# Altium schematic sheet 02_CPU_SYSTEM.SchDoc
size A3; SheetNumber: 2
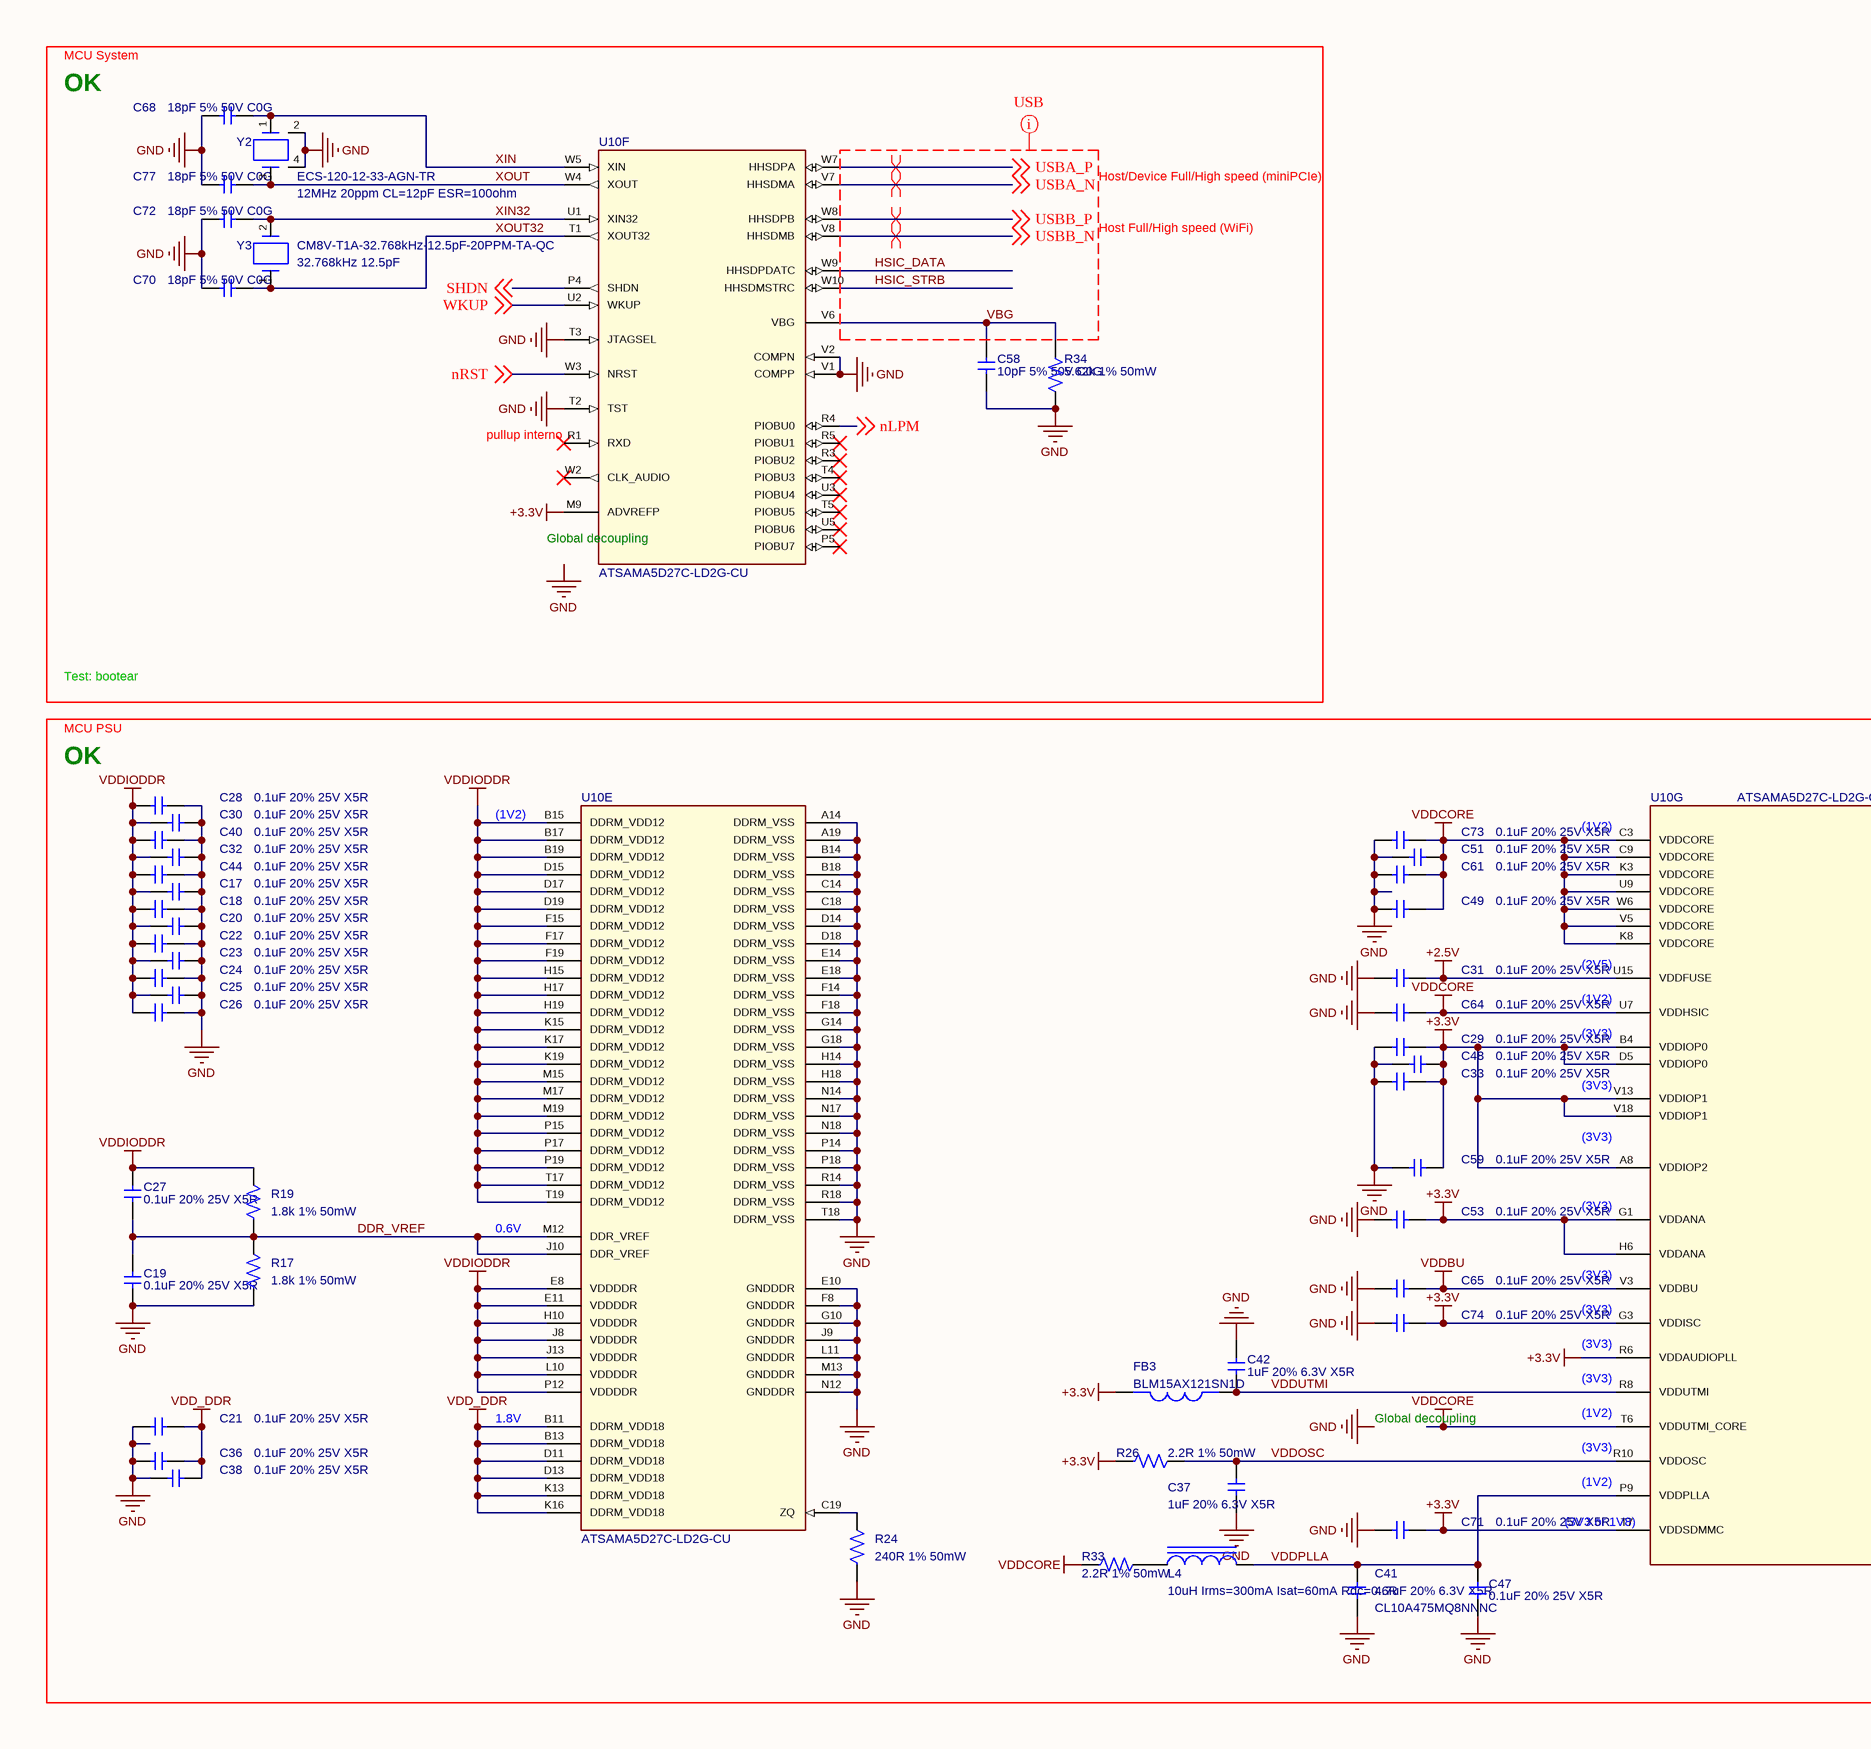
[diagram p0: 02_CPU_SYSTEM.SchDoc, left]
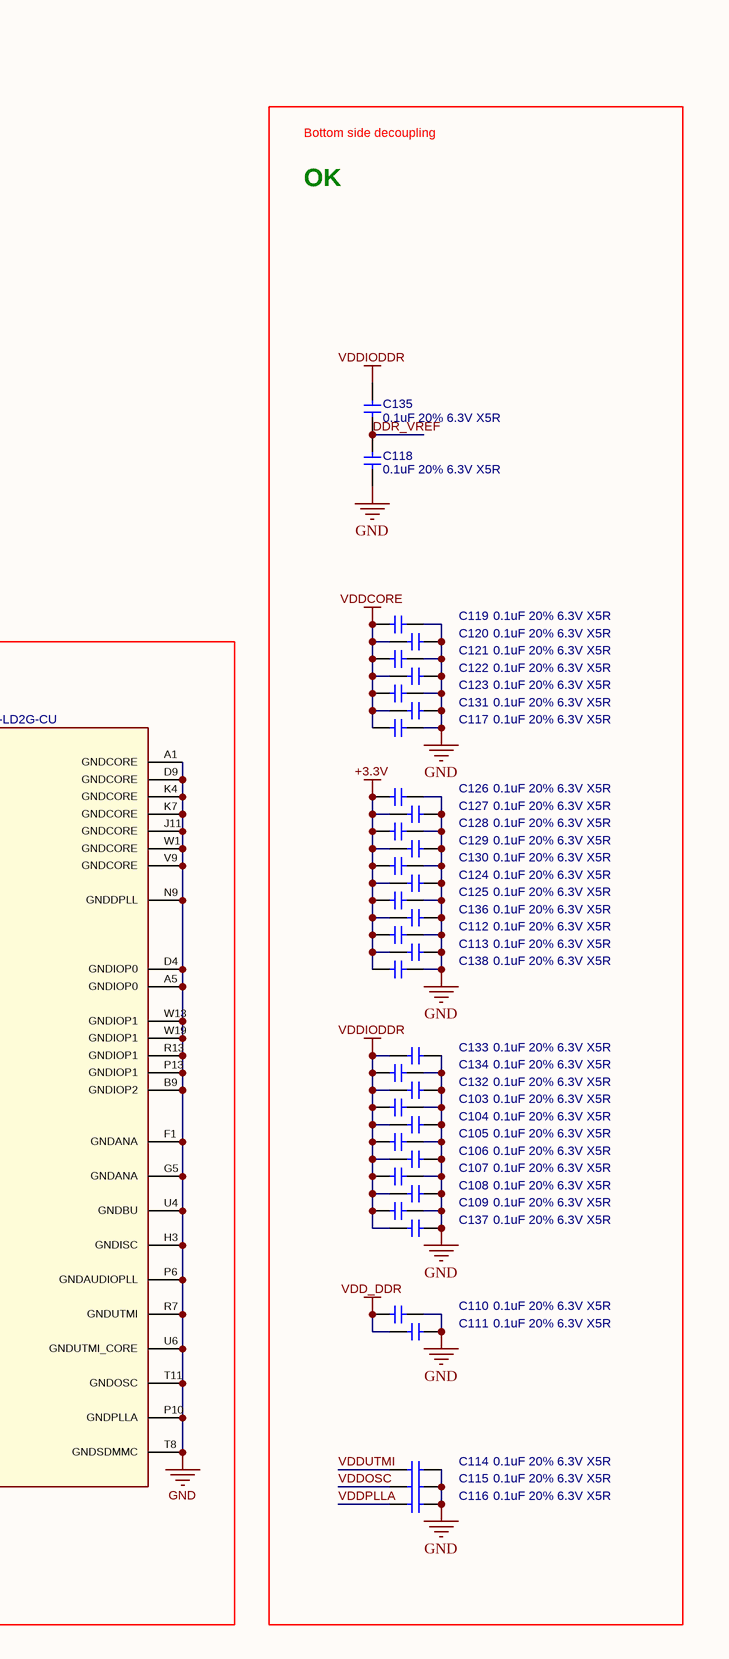
[diagram p1: 02_CPU_SYSTEM.SchDoc, right]

## Parts
C17  0.1uF 20% 25V X5R  [CAPC1005N]
C18  0.1uF 20% 25V X5R  [CAPC1005N]
C19  0.1uF 20% 25V X5R  [CAPC1005N]
C20  0.1uF 20% 25V X5R  [CAPC1005N]
C21  0.1uF 20% 25V X5R  [CAPC1005N]
C22  0.1uF 20% 25V X5R  [CAPC1005N]
C23  0.1uF 20% 25V X5R  [CAPC1005N]
C24  0.1uF 20% 25V X5R  [CAPC1005N]
C25  0.1uF 20% 25V X5R  [CAPC1005N]
C26  0.1uF 20% 25V X5R  [CAPC1005N]
C27  0.1uF 20% 25V X5R  [CAPC1005N]
C28  0.1uF 20% 25V X5R  [CAPC1005N]
C29  0.1uF 20% 25V X5R  [CAPC1005N]
C30  0.1uF 20% 25V X5R  [CAPC1005N]
C31  0.1uF 20% 25V X5R  [CAPC1005N]
C32  0.1uF 20% 25V X5R  [CAPC1005N]
C33  0.1uF 20% 25V X5R  [CAPC1005N]
C36  0.1uF 20% 25V X5R  [CAPC1005N]
C37  1uF 20% 6.3V X5R  [CAPC1005N]
C38  0.1uF 20% 25V X5R  [CAPC1005N]
C40  0.1uF 20% 25V X5R  [CAPC1005N]
C41  4.7uF 20% 6.3V X5R  MFG_PN: CL10A475MQ8NNNC  [CAPC1608X90N]
C42  1uF 20% 6.3V X5R  [CAPC1005N]
C44  0.1uF 20% 25V X5R  [CAPC1005N]
C47  0.1uF 20% 25V X5R  [CAPC1005N]
C48  0.1uF 20% 25V X5R  [CAPC1005N]
C49  0.1uF 20% 25V X5R  [CAPC1005N]
C51  0.1uF 20% 25V X5R  [CAPC1005N]
C53  0.1uF 20% 25V X5R  [CAPC1005N]
C58  10pF 5% 50V C0G  [CAPC1005N]
C59  0.1uF 20% 25V X5R  [CAPC1005N]
C61  0.1uF 20% 25V X5R  [CAPC1005N]
C64  0.1uF 20% 25V X5R  [CAPC1005N]
C65  0.1uF 20% 25V X5R  [CAPC1005N]
C68  18pF 5% 50V C0G  [CAPC1005N]
C70  18pF 5% 50V C0G  [CAPC1005N]
C71  0.1uF 20% 25V X5R  [CAPC1005N]
C72  18pF 5% 50V C0G  [CAPC1005N]
C73  0.1uF 20% 25V X5R  [CAPC1005N]
C74  0.1uF 20% 25V X5R  [CAPC1005N]
C77  18pF 5% 50V C0G  [CAPC1005N]
C103  0.1uF 20% 6.3V X5R  [CAPC0603N]
C104  0.1uF 20% 6.3V X5R  [CAPC0603N]
C105  0.1uF 20% 6.3V X5R  [CAPC0603N]
C106  0.1uF 20% 6.3V X5R  [CAPC0603N]
C107  0.1uF 20% 6.3V X5R  [CAPC0603N]
C108  0.1uF 20% 6.3V X5R  [CAPC0603N]
C109  0.1uF 20% 6.3V X5R  [CAPC0603N]
C110  0.1uF 20% 6.3V X5R  [CAPC0603N]
C111  0.1uF 20% 6.3V X5R  [CAPC0603N]
C112  0.1uF 20% 6.3V X5R  [CAPC0603N]
C113  0.1uF 20% 6.3V X5R  [CAPC0603N]
C114  0.1uF 20% 6.3V X5R  [CAPC0603N]
C115  0.1uF 20% 6.3V X5R  [CAPC0603N]
C116  0.1uF 20% 6.3V X5R  [CAPC0603N]
C117  0.1uF 20% 6.3V X5R  [CAPC0603N]
C118  0.1uF 20% 6.3V X5R  [CAPC0603N]
C119  0.1uF 20% 6.3V X5R  [CAPC0603N]
C120  0.1uF 20% 6.3V X5R  [CAPC0603N]
C121  0.1uF 20% 6.3V X5R  [CAPC0603N]
C122  0.1uF 20% 6.3V X5R  [CAPC0603N]
C123  0.1uF 20% 6.3V X5R  [CAPC0603N]
C124  0.1uF 20% 6.3V X5R  [CAPC0603N]
C125  0.1uF 20% 6.3V X5R  [CAPC0603N]
C126  0.1uF 20% 6.3V X5R  [CAPC0603N]
C127  0.1uF 20% 6.3V X5R  [CAPC0603N]
C128  0.1uF 20% 6.3V X5R  [CAPC0603N]
C129  0.1uF 20% 6.3V X5R  [CAPC0603N]
C130  0.1uF 20% 6.3V X5R  [CAPC0603N]
C131  0.1uF 20% 6.3V X5R  [CAPC0603N]
C132  0.1uF 20% 6.3V X5R  [CAPC0603N]
C133  0.1uF 20% 6.3V X5R  [CAPC0603N]
C134  0.1uF 20% 6.3V X5R  [CAPC0603N]
C135  0.1uF 20% 6.3V X5R  [CAPC0603N]
C136  0.1uF 20% 6.3V X5R  [CAPC0603N]
C137  0.1uF 20% 6.3V X5R  [CAPC0603N]
C138  0.1uF 20% 6.3V X5R  [CAPC0603N]
FB3  BLM15AX121SN1D  [INDC1005N]
L4  10uH Irms=300mA Isat=60mA Rdc=0.6R  [INDC1608X95N]
R17  1.8k 1% 50mW  [RESC1005X40N]
R19  1.8k 1% 50mW  [RESC1005X40N]
R24  240R 1% 50mW  [RESC1005X40N]
R26  2.2R 1% 50mW  [RESC1005X40N]
R33  2.2R 1% 50mW  [RESC1005X40N]
R34  5.62k 1% 50mW  [RESC1005X40N]
U10  ATSAMA5D27C-LD2G-CU  [TFBGA-361-16X16]  (parts E,F,G of 7)
Y2  ECS-120-12-33-AGN-TR  value 12MHz 20ppm CL=12pF ESR=100ohm  [XTAL3.2x2.5]
Y3  CM8V-T1A-32.768kHz-12.5pF-20PPM-TA-QC  value 32.768kHz 12.5pF  [XTAL2.0x1.2]

## Blocks framed on the sheet
OK: C58 C68 C70 C72 C77 R34 U10 Y2 Y3
OK: C103-C138
OK: C17-C33 C36-C38 C40-C42 C44 C47-C49 C51 C53 C59 C61 C64 C65 C71 C73 C74 FB3 L4 R17 R19 R24 R26 R33 U10

## Nets
+2.5V: C31.1 U10.U15(VDDFUSE)
+3.3V: C29.2 C33.2 C48.2 C53.1 C59.2 C71.2 C74.2 C112.1 C113.1 C124.1 C125.1 C126.1 C127.1 C128.1 C129.1 C130.1 C136.1 C138.1 FB3.1 R26.1 U10.A8(VDDIOP2) U10.B4(VDDIOP0) U10.D5(VDDIOP0) U10.G1(VDDANA) U10.G3(VDDISC) U10.H6(VDDANA) U10.M9(ADVREFP) U10.R6(VDDAUDIOPLL) U10.T7(VDDSDMMC) U10.V13(VDDIOP1) U10.V18(VDDIOP1)
GND: C17.2 C18.2 C19.1 C20.2 C21.1 C22.2 C23.2 C24.2 C25.2 C26.2 C28.2 C29.1 C30.2 C31.2 C32.2 C33.1 C36.1 C37.2 C38.1 C40.2 C41.2 C42.2 C44.2 C47.1 C48.1 C49.1 C51.1 C53.2 C58.1 C59.1 C61.1 C64.1 C65.2 C68.1 C70.1 C71.1 C72.1 C73.1 C74.1 C77.1 C103.2 C104.2 C105.2 C106.2 C107.2 C108.2 C109.2 C110.2 C111.2 C112.2 C113.2 C114.2 C115.2 C116.2 C117.2 C118.2 C119.2 C120.2 C121.2 C122.2 C123.2 C124.2 C125.2 C126.2 C127.2 C128.2 C129.2 C130.2 C131.2 C132.2 C133.2 C134.2 C136.2 C137.2 C138.2 R17.1 R24.1 R34.2 U10.A1(GNDCORE) U10.A5(GNDIOP0) U10.A14(DDRM_VSS) U10.A19(DDRM_VSS) U10.B9(GNDIOP2) U10.B14(DDRM_VSS) U10.B18(DDRM_VSS) U10.C14(DDRM_VSS) U10.C18(DDRM_VSS) U10.D4(GNDIOP0) U10.D9(GNDCORE) U10.D14(DDRM_VSS) U10.D18(DDRM_VSS) U10.E10(GNDDDR) U10.E14(DDRM_VSS) U10.E18(DDRM_VSS) U10.F1(GNDANA) U10.F8(GNDDDR) U10.F14(DDRM_VSS) U10.F18(DDRM_VSS) U10.G5(GNDANA) U10.G10(GNDDDR) U10.G14(DDRM_VSS) U10.G18(DDRM_VSS) U10.H3(GNDISC) U10.H14(DDRM_VSS) U10.H18(DDRM_VSS) U10.J9(GNDDDR) U10.J11(GNDCORE) U10.K4(GNDCORE) U10.K7(GNDCORE) U10.L11(GNDDDR) U10.M13(GNDDDR) U10.N9(GNDDPLL) U10.N12(GNDDDR) U10.N14(DDRM_VSS) U10.N17(DDRM_VSS) U10.N18(DDRM_VSS) U10.P6(GNDAUDIOPLL) U10.P10(GNDPLLA) U10.P13(GNDIOP1) U10.P14(DDRM_VSS) U10.P18(DDRM_VSS) U10.R7(GNDUTMI) U10.R13(GNDIOP1) U10.R14(DDRM_VSS) U10.R18(DDRM_VSS) U10.T2(TST) U10.T3(JTAGSEL) U10.T8(GNDSDMMC) U10.T11(GNDOSC) U10.T18(DDRM_VSS) U10.U4(GNDBU) U10.U6(GNDUTMI_CORE) U10.V1(COMPP) U10.V2(COMPN) U10.V9(GNDCORE) U10.W1(GNDCORE) U10.W13(GNDIOP1) U10.W19(GNDIOP1) Y2.2(GND) Y2.4(GND)
VDD_DDR: C21.2 C36.2 C38.2 C110.1 C111.1 U10.B11(DDRM_VDD18) U10.B13(DDRM_VDD18) U10.D11(DDRM_VDD18) U10.D13(DDRM_VDD18) U10.K13(DDRM_VDD18) U10.K16(DDRM_VDD18)
VDDBU: C65.1 U10.V3(VDDBU)
VDDCORE: C49.2 C51.2 C61.2 C64.2 C73.2 C117.1 C119.1 C120.1 C121.1 C122.1 C123.1 C131.1 R33.1 U10.C3(VDDCORE) U10.C9(VDDCORE) U10.K3(VDDCORE) U10.K8(VDDCORE) U10.T6(VDDUTMI_CORE) U10.U7(VDDHSIC) U10.U9(VDDCORE) U10.V5(VDDCORE) U10.W6(VDDCORE)
VDDIODDR: C17.1 C18.1 C20.1 C22.1 C23.1 C24.1 C25.1 C26.1 C27.2 C28.1 C30.1 C32.1 C40.1 C44.1 C103.1 C104.1 C105.1 C106.1 C107.1 C108.1 C109.1 C132.1 C133.1 C134.1 C135.2 C137.1 R19.2 U10.B15(DDRM_VDD12) U10.B17(DDRM_VDD12) U10.B19(DDRM_VDD12) U10.D15(DDRM_VDD12) U10.D17(DDRM_VDD12) U10.D19(DDRM_VDD12) U10.E8(VDDDDR) U10.E11(VDDDDR) U10.F15(DDRM_VDD12) U10.F17(DDRM_VDD12) U10.F19(DDRM_VDD12) U10.H10(VDDDDR) U10.H15(DDRM_VDD12) U10.H17(DDRM_VDD12) U10.H19(DDRM_VDD12) U10.J8(VDDDDR) U10.J13(VDDDDR) U10.K15(DDRM_VDD12) U10.K17(DDRM_VDD12) U10.K19(DDRM_VDD12) U10.L10(VDDDDR) U10.M15(DDRM_VDD12) U10.M17(DDRM_VDD12) U10.M19(DDRM_VDD12) U10.P12(VDDDDR) U10.P15(DDRM_VDD12) U10.P17(DDRM_VDD12) U10.P19(DDRM_VDD12) U10.T17(DDRM_VDD12) U10.T19(DDRM_VDD12)
DDR_VREF: C19.2 C27.1 C118.1 C135.1 R17.2 R19.1 U10.J10(DDR_VREF) U10.M12(DDR_VREF)
HSIC_DATA: U10.W9(HHSDPDATC)
HSIC_STRB: U10.W10(HHSDMSTRC)
nLPM: U10.R4(PIOBU0) ; off-sheet nLPM
nRST: U10.W3(NRST) ; off-sheet nRST
SHDN: U10.P4(SHDN) ; off-sheet SHDN
USBA_N: U10.V7(HHSDMA) ; off-sheet USBA_N
USBA_P: U10.W7(HHSDPA) ; off-sheet USBA_P
USBB_N: U10.V8(HHSDMB) ; off-sheet USBB_N
USBB_P: U10.W8(HHSDPB) ; off-sheet USBB_P
VBG: C58.2 R34.1 U10.V6(VBG)
VDDOSC: C37.1 C115.1 R26.2 U10.R10(VDDOSC)
VDDPLLA: C41.1 C47.2 C116.1 L4.2 U10.P9(VDDPLLA)
VDDUTMI: C42.1 C114.1 FB3.2 U10.R8(VDDUTMI)
WKUP: U10.U2(WKUP) ; off-sheet WKUP
XIN: C68.2 U10.W5(XIN) Y2.1(S1)
XIN32: C72.2 U10.U1(XIN32) Y3.2(S2)
XOUT: C77.2 U10.W4(XOUT) Y2.3(S2)
XOUT32: C70.2 U10.T1(XOUT32) Y3.1(S1)
NetL4_1: L4.1 R33.2
NetR24_2: R24.2 U10.C19(ZQ)

Not connected (* = marked no-connect by the designer): U10 P5(PIOBU7)* R1(RXD)* R3(PIOBU2)* R5(PIOBU1)* T4(PIOBU3)* T5(PIOBU5)* U3(PIOBU4)* U5(PIOBU6)* W2(CLK_AUDIO)*

## Layout directives
net class USB: HSIC_DATA, HSIC_STRB, USBA_N, USBA_P, USBB_N, USBB_P, VBG
differential pair: USBA_N, USBA_P, USBB_N, USBB_P

## Notes on the sheet
- MCU System
- Host/Device Full/High speed (miniPCIe)
- Host Full/High speed (WiFi)
- Bottom side decoupling
- (near U10) pullup interno
- (near U10) Global decoupling
- Test: bootear
- MCU PSU
- (near U10) (1V2)
- (near U10) (3V3)
- (near U10) (2V5)
- (near U10) 0.6V
- (near U10) 1.8V
- Global decoupling
- (near U10) (3V3 or 1V8)
- Labels drawn without touching a wire or pin: GND

## Library data of the parts
C17-C33 C36 C38 C40 C44 C47-C49 C51 C53 C59 C61 C64 C65 C71 C73 C74 = C_Dup1: Capacitor, Ceramic; FP_DESC: C0402; MFG_PN: CL05A104KA5NNNC; MFG: SAMSUNG; Symbol Checked: Ok; Replacement Allowed: Ask; Footprint Checked: Assign OK, Footprint OK; TECHNOLOGY: X5R; TOLERANCE: 20%; VALUE: 0.1uF; VOLTAGE: 25V
C37 C42 = C_Dup1: Capacitor, Ceramic; MFG: SAMSUNG; MFG_PN: CL05A105KQ5NNNC; FP_DESC: C0402; Symbol Checked: Ok; Replacement Allowed: Ask; Footprint Checked: Assign OK, Footprint OK; TECHNOLOGY: X5R; TOLERANCE: 20%; VALUE: 1uF; VOLTAGE: 6.3V
C41 = C_Dup1: Capacitor, Ceramic; FP_DESC: C0603; MFG: SAMSUNG; Symbol Checked: Ok; Replacement Allowed: Ask; Footprint Checked: Assign OK, Footprint OK; TECHNOLOGY: X5R; TOLERANCE: 20%; VALUE: 4.7uF; VOLTAGE: 6.3V
C58 C68 C70 C72 C77 = C_Dup1: Capacitor, Ceramic; FP_DESC: C0402; MFG_PN: <GENERIC>; Symbol Checked: Ok; Replacement Allowed: Yes; MFG: <GENERIC>; Footprint Checked: Assign OK, Footprint OK; TECHNOLOGY: C0G; TOLERANCE: 5%; VOLTAGE: 50V
  C58: VALUE: 10pF
  C68 C70 C72 C77: VALUE: 18pF
C103-C138 = C_Dup1: Capacitor, Ceramic; FP_DESC: C0201; MFG_PN: CL03A104KQ3NNNC; MFG: SAMSUNG; Symbol Checked: Ok; Replacement Allowed: Ask; Footprint Checked: Assign OK, Footprint OK; TECHNOLOGY: X5R; TOLERANCE: 20%; VALUE: 0.1uF; VOLTAGE: 6.3V
FB3 = Filtre ferrites CMS-742792093: Ferrite Bead; MFG: MURATA; FP_DESC: L0402; Symbol Checked: Ok; Replacement Allowed: No; MFG_PN: BLM15AX121SN1D; Footprint Checked: Assign OK, Footprint OK
L4 = L_CORE: Inductor, Ferrite core; MFG: TDK; Symbol Checked: Ok; FP_DESC: L0603; MFG_PN: MLZ1608N100LT000; Replacement Allowed: No; Footprint Checked: Assign OK, Footprint OK; Value: 10uH; EXTRA_DATA: Irms=300mA Isat=60mA Rdc=0.6R
R17 R19 R24 R26 R33 R34 = R: Resistor, SMD; FP_DESC: R0402; MFG_PN: <GENERIC>; Symbol Checked: Ok; Replacement Allowed: Yes; MFG: <GENERIC>; Footprint Checked: Assign OK, Footprint OK; POWER: 50mW; TOLERANCE: 1%
  R17 R19: VALUE: 1.8k
  R24: VALUE: 240R
  R26 R33: VALUE: 2.2R
  R34: VALUE: 5.62k
U10 = MIC8130: SAMA5D2 MPU with 2Gb LPDDR2 x32 TFBGA-361; MFG: MICROCHIP; Symbol Checked: Ok; Replacement Allowed: No; Footprint Checked: Assign OK, Footprint OK; FP_DESC: BGA-361; MFG_PN: ATSAMA5D27C-LD2G-CU
Y2 = CS10-12MHz: Crystal; MFG: ECS; FP_DESC: XTAL 3.2x2.5; Symbol Checked: Ok; Replacement Allowed: Ask; MFG_PN: ECS-120-12-33-AGN-TR; Footprint Checked: Assign OK, Footprint OK
Y3 = CS10-12MHz: Crystal; MFG: TXC; FP_DESC: XTAL 2.0x1.2; Symbol Checked: Ok; Replacement Allowed: Ask; MFG_PN: CM8V-T1A-32.768kHz-12.5pF-20PPM-TA-QC; Footprint Checked: Assign OK, Footprint OK